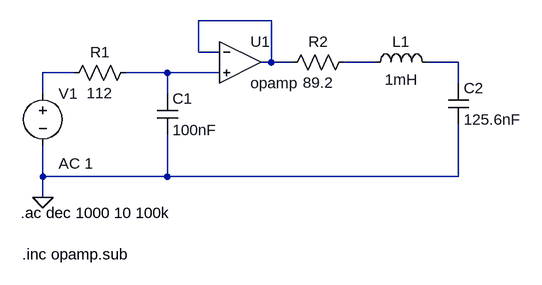
[diagram p0: schematic filtro1.asc]
filtro1.asc, the LTspice schematic file:
Version 4
SHEET 1 880 680
WIRE 384 16 272 16
WIRE 272 64 272 16
WIRE 304 64 272 64
WIRE 384 80 384 16
WIRE 384 80 368 80
WIRE 416 80 384 80
WIRE 544 80 496 80
WIRE 672 80 624 80
WIRE 80 96 32 96
WIRE 224 96 160 96
WIRE 304 96 224 96
WIRE 672 112 672 80
WIRE 32 128 32 96
WIRE 224 128 224 96
WIRE 32 256 32 208
WIRE 224 256 224 192
WIRE 224 256 32 256
WIRE 672 256 672 176
WIRE 672 256 224 256
WIRE 32 288 32 256
FLAG 32 288 0
SYMBOL voltage 32 112 R0
WINDOW 123 24 124 Left 2
WINDOW 39 0 0 Left 0
SYMATTR InstName V1
SYMATTR Value ""
SYMATTR Value2 AC 1
SYMBOL res 176 80 R90
WINDOW 0 0 56 VBottom 2
WINDOW 3 32 56 VTop 2
SYMATTR InstName R1
SYMATTR Value 112
SYMBOL cap 208 128 R0
SYMATTR InstName C1
SYMATTR Value 100nF
SYMBOL res 512 64 R90
WINDOW 0 0 56 VBottom 2
WINDOW 3 32 56 VTop 2
SYMATTR InstName R2
SYMATTR Value 89.2
SYMBOL ind 528 96 R270
WINDOW 0 32 56 VTop 2
WINDOW 3 5 56 VBottom 2
SYMATTR InstName L1
SYMATTR Value 1mH
SYMBOL cap 656 112 R0
SYMATTR InstName C2
SYMATTR Value 125.6nF
SYMBOL OpAmps\\opamp 336 16 R0
SYMATTR InstName U1
TEXT -2 312 Left 2 !.ac dec 1000 10 100k
TEXT 0 376 Left 2 !.inc opamp.sub

The netlist it stands for:
* filtro1.asc
V1 N004 0 AC 1
R1 N005 N004 112
C1 N005 0 100nF
R2 N002 N001 89.2
L1 N002 N003 1mH
C2 N003 0 125.6nF
XU1 N001 N005 N001 opamp Aol=100K GBW=10Meg  ; pins invin noninvin out
.ac dec 1000 10 100k
.inc opamp.sub
.backanno
.end